# EAGLE design IORELAY8 (EAGLE 9.5.1)
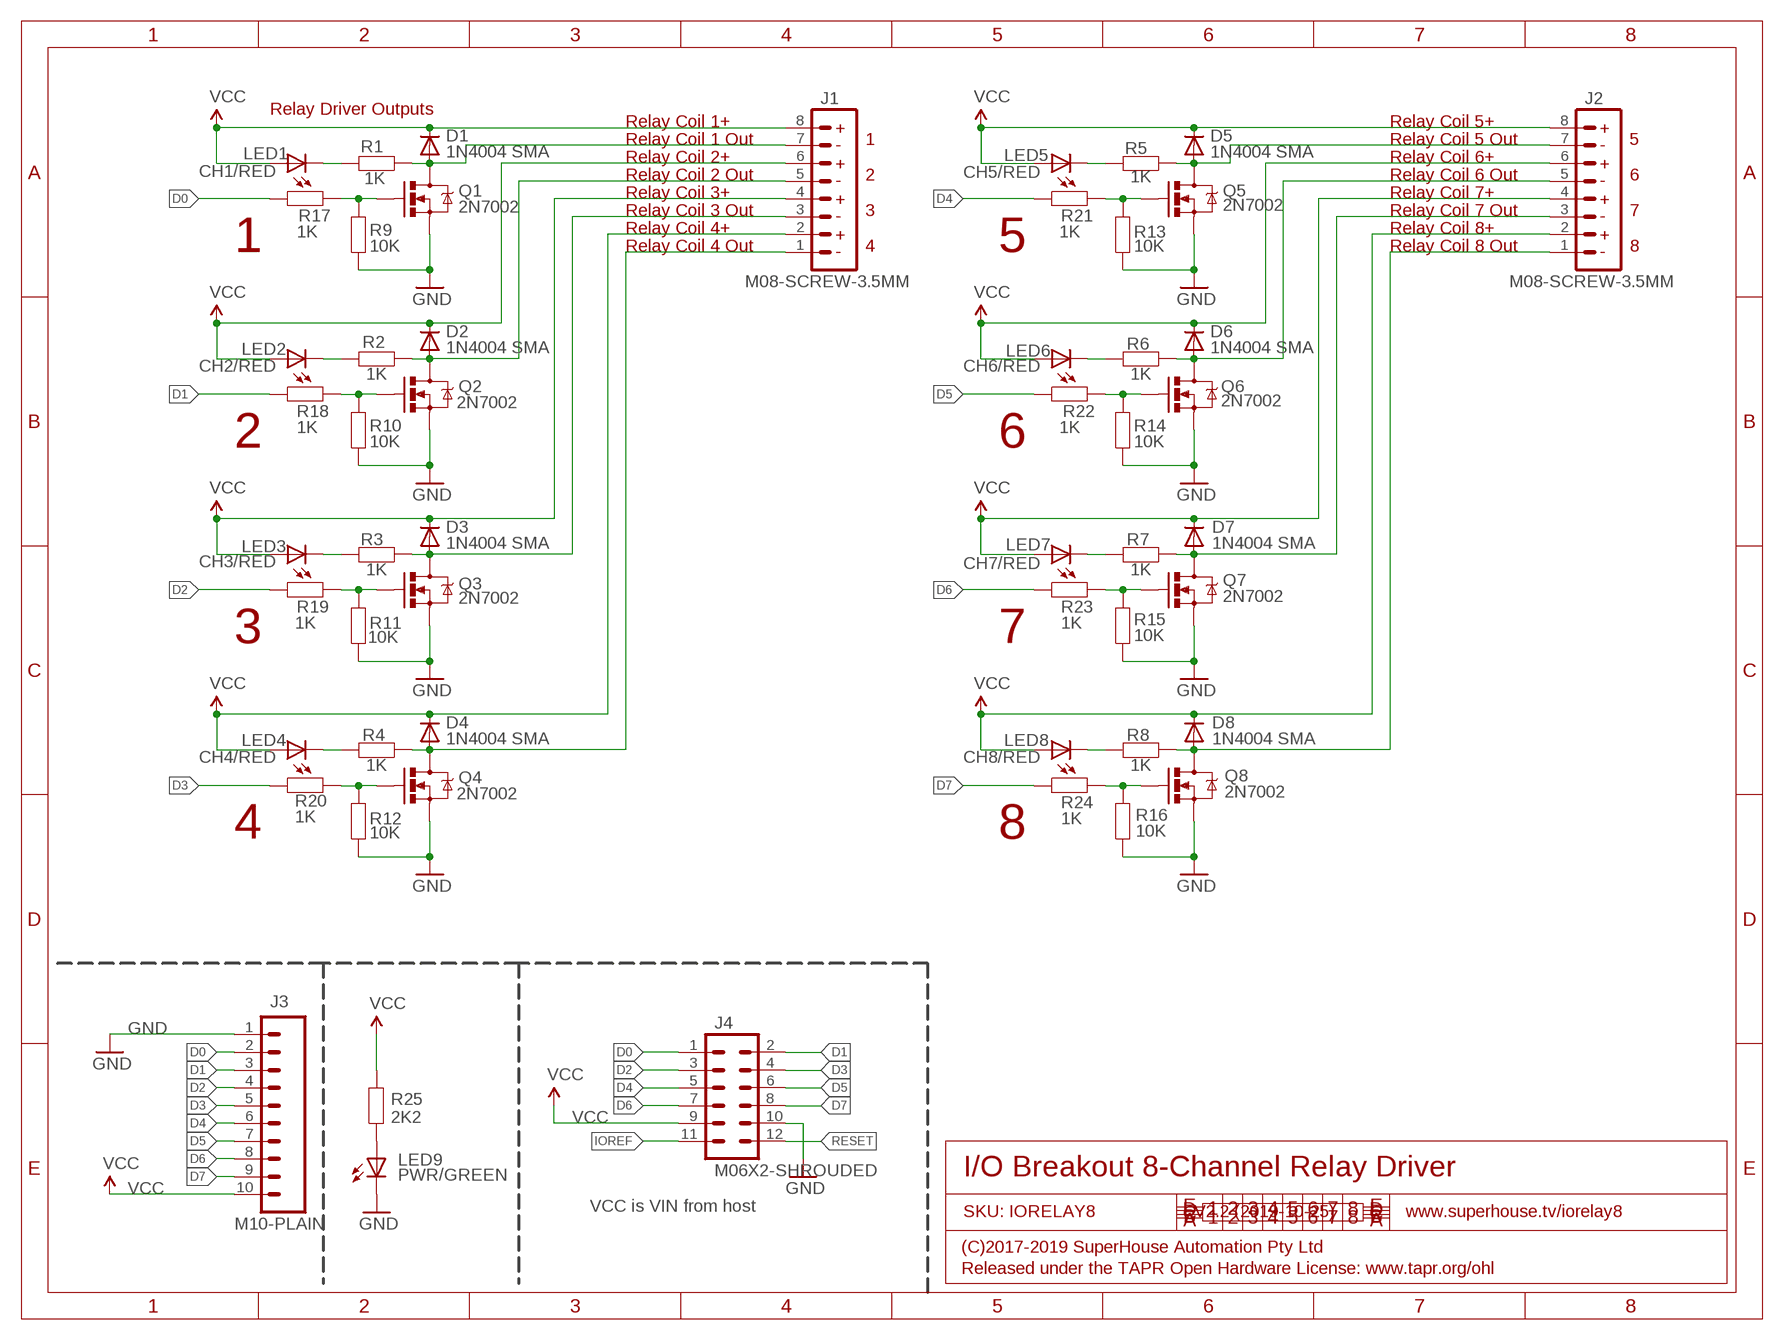
[diagram p0: schematic, sheet 1]

## Parts
D1  1N4004 SMA  DIODESMA  [SMA-DIODE]
D2  1N4004 SMA  DIODESMA  [SMA-DIODE]
D3  1N4004 SMA  DIODESMA  [SMA-DIODE]
D4  1N4004 SMA  DIODESMA  [SMA-DIODE]
D5  1N4004 SMA  DIODESMA  [SMA-DIODE]
D6  1N4004 SMA  DIODESMA  [SMA-DIODE]
D7  1N4004 SMA  DIODESMA  [SMA-DIODE]
D8  1N4004 SMA  DIODESMA  [SMA-DIODE]
J1  M08-SCREW-3.5MM  [SCREWTERMINAL_3.5MM_8]
J2  M08-SCREW-3.5MM  [SCREWTERMINAL_3.5MM_8]
J3  M10-PLAIN  [1X10]
J4  M06X2-SHROUDED  [2X6-SHROUDED]
LED1  CH1/RED  LED0603  [LED-0603]
LED2  CH2/RED  LED0603  [LED-0603]
LED3  CH3/RED  LED0603  [LED-0603]
LED4  CH4/RED  LED0603  [LED-0603]
LED5  CH5/RED  LED0603  [LED-0603]
LED6  CH6/RED  LED0603  [LED-0603]
LED7  CH7/RED  LED0603  [LED-0603]
LED8  CH8/RED  LED0603  [LED-0603]
LED9  PWR/GREEN  LED0603  [LED-0603]
Q1  2N7002  MOSFET-NCHANNEL-233  [SOT23-3]
Q2  2N7002  MOSFET-NCHANNEL-233  [SOT23-3]
Q3  2N7002  MOSFET-NCHANNEL-233  [SOT23-3]
Q4  2N7002  MOSFET-NCHANNEL-233  [SOT23-3]
Q5  2N7002  MOSFET-NCHANNEL-233  [SOT23-3]
Q6  2N7002  MOSFET-NCHANNEL-233  [SOT23-3]
Q7  2N7002  MOSFET-NCHANNEL-233  [SOT23-3]
Q8  2N7002  MOSFET-NCHANNEL-233  [SOT23-3]
R1  1K  RESISTOR0603  [R0603]
R2  1K  RESISTOR0603  [R0603]
R3  1K  RESISTOR0603  [R0603]
R4  1K  RESISTOR0603  [R0603]
R5  1K  RESISTOR0603  [R0603]
R6  1K  RESISTOR0603  [R0603]
R7  1K  RESISTOR0603  [R0603]
R8  1K  RESISTOR0603  [R0603]
R9  10K  RESISTOR0603  [R0603]
R10  10K  RESISTOR0603  [R0603]
R11  10K  RESISTOR0603  [R0603]
R12  10K  RESISTOR0603  [R0603]
R13  10K  RESISTOR0603  [R0603]
R14  10K  RESISTOR0603  [R0603]
R15  10K  RESISTOR0603  [R0603]
R16  10K  RESISTOR0603  [R0603]
R17  1K  RESISTOR0603  [R0603]
R18  1K  RESISTOR0603  [R0603]
R19  1K  RESISTOR0603  [R0603]
R20  1K  RESISTOR0603  [R0603]
R21  1K  RESISTOR0603  [R0603]
R22  1K  RESISTOR0603  [R0603]
R23  1K  RESISTOR0603  [R0603]
R24  1K  RESISTOR0603  [R0603]
R25  2K2  RESISTOR0603  [R0603]

## Nets
D0: J3.2 J4.1 R17.2
D1: J3.3 J4.2 R18.2
D2: J3.4 J4.3 R19.2
D3: J3.5 J4.4 R20.2
D4: J3.6 J4.5 R21.2
D5: J3.7 J4.6 R22.2
D6: J3.8 J4.7 R23.2
D7: J3.9 J4.8 R24.2
GND: J3.1 J4.10 LED9.C Q1.2(S) Q2.2(S) Q3.2(S) Q4.2(S) Q5.2(S) Q6.2(S) Q7.2(S) Q8.2(S) R9.1 R10.1 R11.1 R12.1 R13.1 R14.1 R15.1 R16.1
IOREF: J4.11
N$1: Q1.1(G) R9.2 R17.1
N$3: D2.A J1.5 Q2.3(D) R2.2
N$4: LED9.A R25.1
N$5: D1.A J1.7 Q1.3(D) R1.2
N$8: Q2.1(G) R10.2 R18.1
N$9: D3.A J1.3 Q3.3(D) R3.2
N$10: Q3.1(G) R11.2 R19.1
N$11: D4.A J1.1 Q4.3(D) R4.2
N$12: Q4.1(G) R12.2 R20.1
N$13: D5.A J2.7 Q5.3(D) R5.2
N$14: Q5.1(G) R13.2 R21.1
N$15: D6.A J2.5 Q6.3(D) R6.2
N$16: Q6.1(G) R14.2 R22.1
N$17: D7.A J2.3 Q7.3(D) R7.2
N$18: Q7.1(G) R15.2 R23.1
N$19: D8.A J2.1 Q8.3(D) R8.2
N$20: Q8.1(G) R16.2 R24.1
N$21: LED2.C R2.1
N$22: LED4.C R4.1
N$23: LED3.C R3.1
N$24: LED1.C R1.1
N$25: LED5.C R5.1
N$26: LED6.C R6.1
N$27: LED7.C R7.1
N$28: LED8.C R8.1
RESET: J4.12
VCC: D1.C D2.C D3.C D4.C D5.C D6.C D7.C D8.C J1.2 J1.4 J1.6 J1.8 J2.2 J2.4 J2.6 J2.8 J3.10 J4.9 LED1.A LED2.A LED3.A LED4.A LED5.A LED6.A LED7.A LED8.A R25.2

## Notes on the sheet
- Relay Driver Outputs
- Relay Coil 1+ | Relay Coil 5+
- + | +
- Relay Coil 1 Out | 1 | Relay Coil 5 Out | 5
- - | -
- Relay Coil 2+ | Relay Coil 6+
- + | +
- Relay Coil 2 Out | 2 | Relay Coil 6 Out | 6
- - | -
- Relay Coil 3+ | Relay Coil 7+
- + | +
- Relay Coil 3 Out | 3 | Relay Coil 7 Out | 7
- - | -
- Relay Coil 4+ | Relay Coil 8+
- + | +
- 1 | Relay Coil 4 Out | 4 | 5 | Relay Coil 8 Out | 8
- - | -
- 2 | 6
- 3 | 7
- 4 | 8
- I/O Breakout 8-Channel Relay Driver
- VCC is VIN from host
- SKU: IORELAY8 | V2.2 (2019-10-25) | www.superhouse.tv/iorelay8
- (C)2017-2019 SuperHouse Automation Pty Ltd
- Released under the TAPR Open Hardware License: www.tapr.org/ohl

## Library data of the parts
D1-D8 = SuperHouse-DiscreteSemi:DIODE: Diode Standard reverse protection diodes and small signal diodes. SMA package can handle up to about 1A. SOD-323 can handle about 200mA.
J1 J2 = SuperHouse-Connectors:M08: 8-way header Standard 1x8 header, and screw terminal variations
J3 = SuperHouse-Connectors:M10: 1x10 header
J4 = SuperHouse-Connectors:M06X2: M12 header in 2x6 format
LED1-LED9 = SuperHouse-LEDs:LED: LEDs Standard schematic elements and footprints for 5mm, 3mm, 1206, and 0603 sized LEDs. 5mm - Spark Fun Electronics SKU : COM-00529 (and others)
Q1-Q8 = SuperHouse-DiscreteSemi:MOSFET-NCHANNEL: N-channel MOSFET
R1-R25 = SuperHouse-DiscreteSemi:RESISTOR: Resistor Standard resistors.

## Board
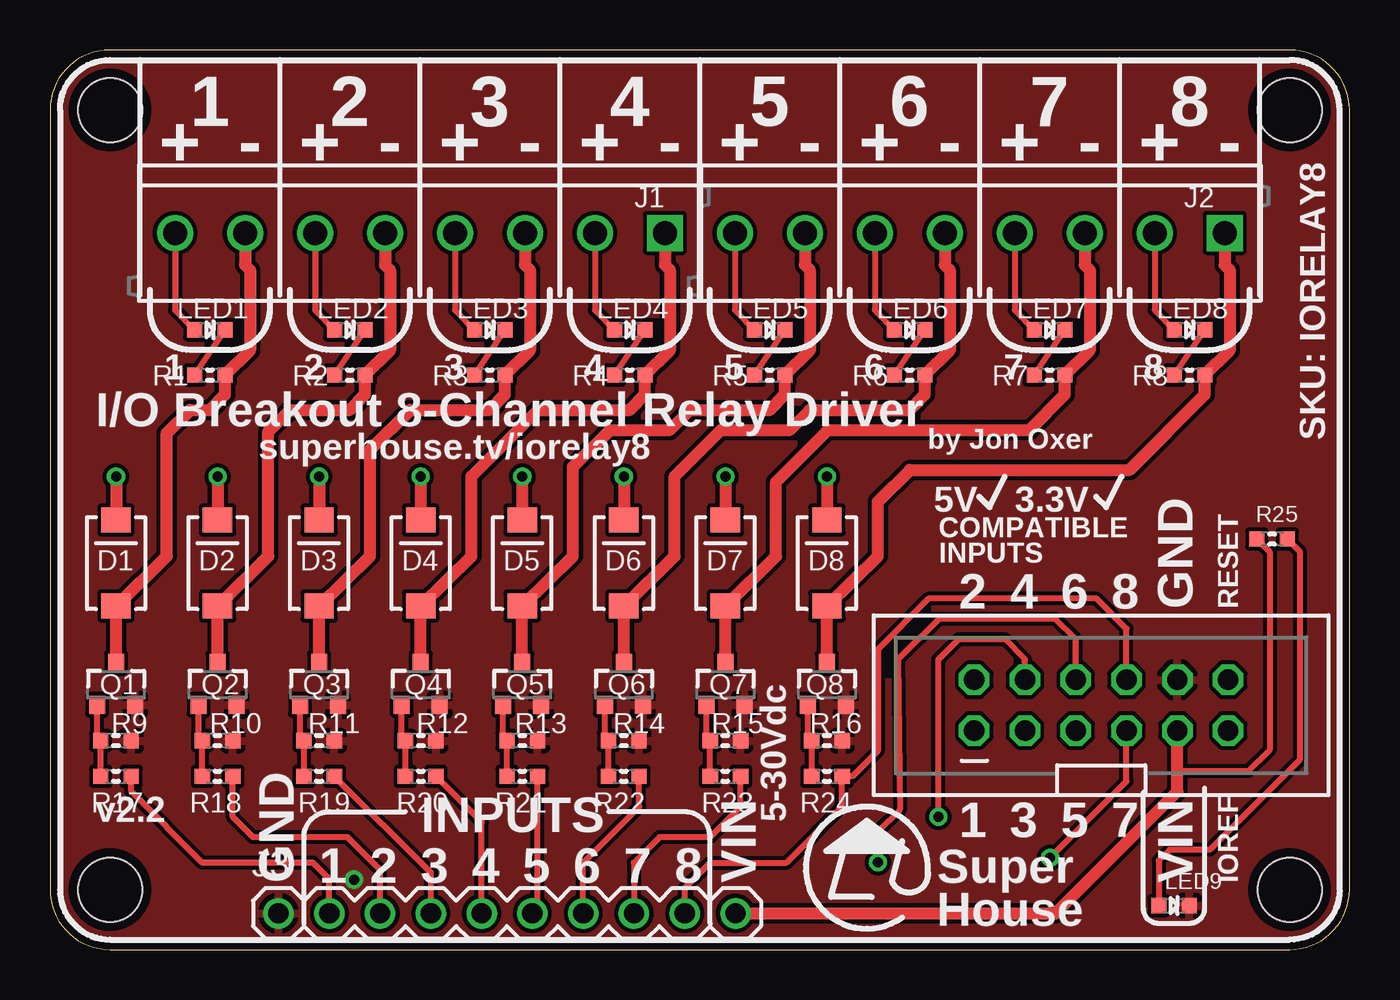
[diagram p1: board, top side]
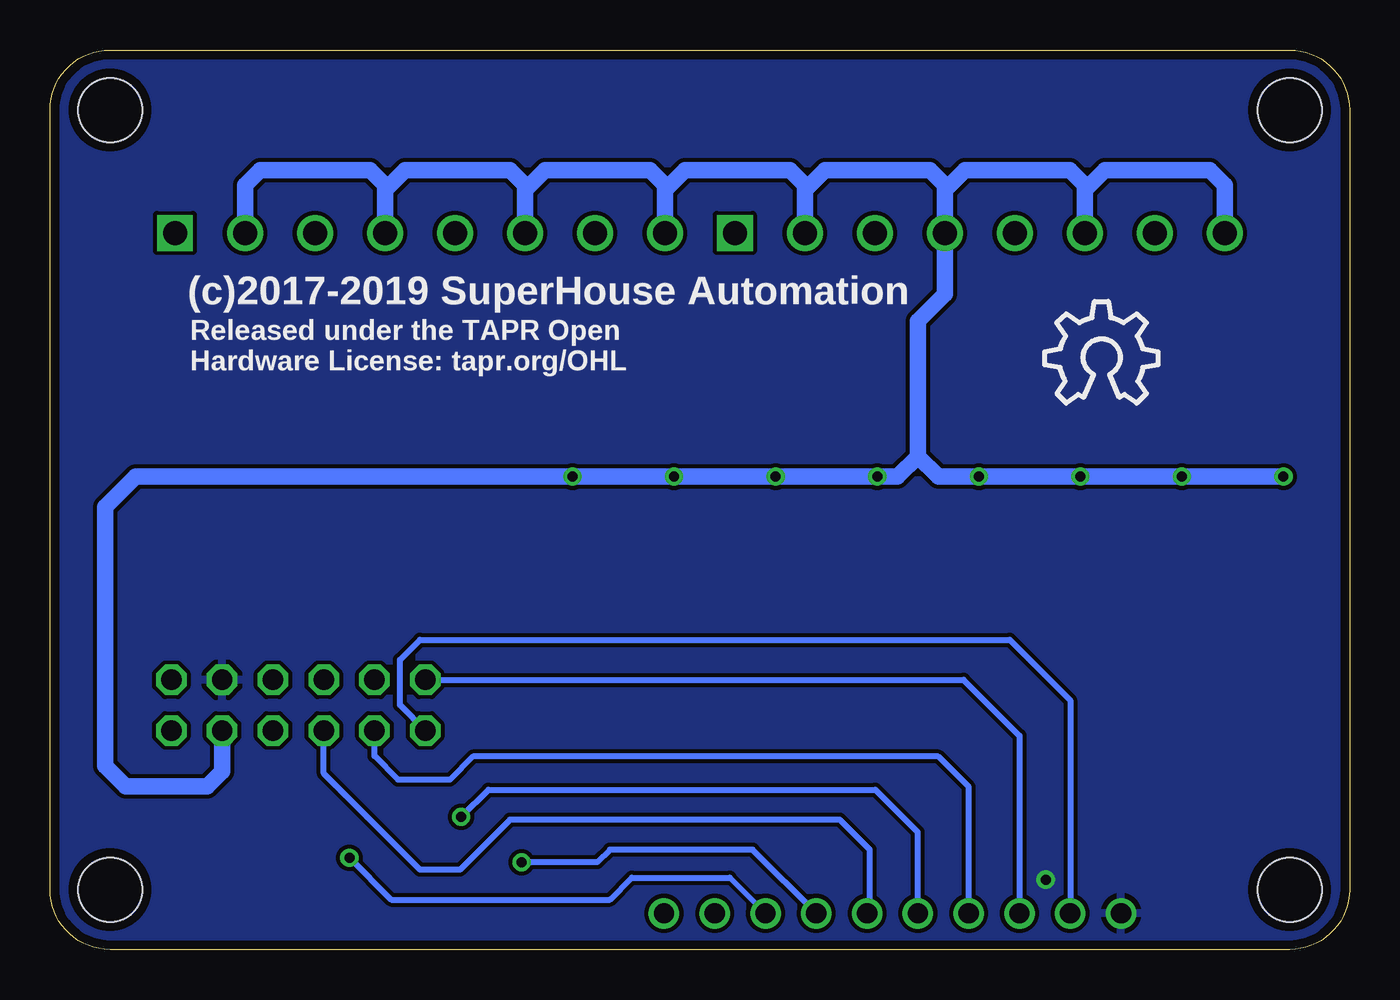
[diagram p2: board, bottom side, seen from below]

Size 65 x 45 mm. Coordinates in mm from the lower left corner, seen from the top.
Outline: 0,3 arc90 3,0 62,0 arc90 65,3 65,42 arc90 62,45 3,45 arc90 0,42 0,3
Copper layers (1*16): Top 0.035mm / dielectric 1.5mm / Bottom 0.035mm
Design rules "SuperHouse-Design-Rules": minimum track width 10mil, minimum drill 24mil, track to track 8mil, track to pad 8mil, pad to pad 8mil, via to via 8mil, smd to smd 6mil, copper to edge 18mil, drill to drill 8mil, minimum pad ring 10mil, minimum via ring 8mil, stop-mask expansion 4mil, vias tented up to drill 0.5mm, thermal gap 10mil
Holes 3.2 mm at 3,3 62,3 3,42 62,42

### Footprints (pad centres in the part's own frame; a part is rotated, then mirrored left to right if it is on the bottom)
SMA-DIODE = smd 1.27 x 1.47: A -2.15,0; C 2.15,0
SCREWTERMINAL_3.5MM_8 = drill 1.2 square: 1 0,0 | drill 1.2: 2 3.5,0; 3 7,0; 4 10.5,0; 5 14,0; 6 17.5,0; 7 21,0; 8 24.5,0
1X10 = drill 1.016: 1 0,0; 2 2.54,0; 3 5.08,0; 4 7.62,0; 5 10.16,0; 6 12.7,0; 7 15.24,0; 8 17.78,0; 9 20.32,0; 10 22.86,0
2X6-SHROUDED = drill 1.016 octagon: 1 0,0; 2 2.54,0; 3 0,-2.54; 4 2.54,-2.54; 5 0,-5.08; 6 2.54,-5.08; 7 0,-7.62; 8 2.54,-7.62; 9 0,-10.16; 10 2.54,-10.16; 11 0,-12.7; 12 2.54,-12.7
LED-0603 = smd 0.762 x 0.762: A -0.762,0; C 0.762,0
SOT23-3 = smd 0.8 x 0.9: 1 -0.95,-1; 2 0.95,-1; 3 0,1.1
R0603 = smd 0.762 x 0.762: 1 -0.762,0; 2 0.762,0

### Placement (x,y rotation side)
D1  3.3,19.34 90 top
D2  8.38,19.34 90 top
D3  13.46,19.34 90 top
D4  18.54,19.34 90 top
D5  23.62,19.34 90 top
D6  28.7,19.34 90 top
D7  33.78,19.34 90 top
D8  38.86,19.34 90 top
J1  30.75,35.85 180 top
J2  58.75,35.85 180 top
J3  11.43,1.81 0 top
J4  46.23,10.95 90 top
LED1  8,31 0 top
LED2  15,31 0 top
LED3  22,31 0 top
LED4  29,31 0 top
LED5  36,31 0 top
LED6  43,31 0 top
LED7  50,31 0 top
LED8  57,31 0 top
LED9  56.22,2.2 0 top
Q1  3.3,13.24 0 top
Q2  8.38,13.24 0 top
Q3  13.46,13.24 0 top
Q4  18.54,13.24 0 top
Q5  23.62,13.24 0 top
Q6  28.7,13.24 0 top
Q7  33.78,13.24 0 top
Q8  38.86,13.24 0 top
R1  8,28.73 0 top
R2  15,28.73 0 top
R3  22,28.73 0 top
R4  29,28.73 0 top
R5  36,28.73 0 top
R6  43,28.73 0 top
R7  50,28.73 0 top
R8  57,28.73 0 top
R9  3.3,10.45 180 top
R10  8.38,10.45 180 top
R11  13.46,10.45 180 top
R12  18.54,10.45 180 top
R13  23.62,10.45 180 top
R14  28.7,10.45 180 top
R15  33.78,10.45 180 top
R16  38.86,10.45 180 top
R17  3.3,8.67 0 top
R18  8.38,8.67 0 top
R19  13.46,8.67 0 top
R20  18.54,8.67 0 top
R21  23.62,8.67 0 top
R22  28.7,8.67 0 top
R23  33.78,8.67 0 top
R24  38.86,8.67 0 top
R25  61.13,20.53 180 top
U$6  [OSHW_10X200_NOTEXT]  15.24,27.34 0 bottom

### Tracks (layer width: path | path; a pad name or v marks a point on that pad's centre or on a via)
D0
  Top 0.305: R17.2 4.06,7.91 7.62,4.35 13.15,4.35 13.97,3.53 J3.2
  Bottom 0.305: J4.1 47.5,12.23 47.5,14.5 46.5,15.5 17,15.5 13.97,12.47 J3.2
D1
  Top 0.305: R18.2 9.14,6.64 10.16,5.62 14.88,5.62 16.51,3.99 J3.3
  Bottom 0.305: J4.2 19.3,13.49 16.51,10.7 J3.3
D2
  Top 0.305: J3.4 19.05,3.84 R19.2
  Bottom 0.305: J3.4 19.05,8.14 20.57,9.66 43.84,9.66 45,8.5 47.59,8.5 48.77,9.68 J4.3
D3  (via drill 0.5)
  Top 0.305: v44.43,6.64 44.43,14.5 45.46,15.53 47.75,15.53 48.77,14.51 J4.4 | J3.5 21.59,6.38 R20.2
  Bottom 0.305: J3.5 21.59,5.87 23.72,8 43.07,8 v44.43,6.64
D4
  Top 0.305: J3.6 24.38,2.06 R21.2
  Bottom 0.305: J3.6 arc-90 24,1.94 24,5 25.5,6.5 42,6.5 44.5,4 46.5,4 51.31,8.81 J4.5
D5  (via drill 0.5)
  Top 0.305: R22.2 29.46,7.14 26.67,4.35 J3.7 | v41.42,4.37 41.42,5.92 42.5,7 42.42,14.51 44.45,16.54 50.29,16.54 51.31,15.53 J4.6
  Bottom 0.305: J3.7 29.86,5 37,5 37.63,4.37 v41.42,4.37
D6  (via drill 0.5)
  Top 0.305: R23.2 34.54,7.14 33.02,5.62 30.48,5.62 29.21,4.35 J3.8 | v50.02,4.59 53.85,8.41 J4.7
  Bottom 0.254: 30.99,3.59 J3.8
  Bottom 0.305: v50.02,4.59 47.93,2.5 37,2.5 35.91,3.59 30.99,3.59
D7
  Top 0.305: J4.8 53.85,16.04 52.33,17.56 43.94,17.56 41.4,15.02 41.4,9.93 40.14,8.67 R24.2 39.62,7.14 36.83,4.35 33.02,4.35 31.75,3.08 J3.9
GND  (via drill 0.5)
  other vias: 15.2,3.5
  pour Bottom: 0,42 arc-90 3,45 62,45 arc-90 65,42 65,3 arc-90 62,0 3,0 arc-90 0,3
  pour Top: 0,42 arc-90 3,45 62,45 arc-90 65,42 65,3 arc-90 62,0 3,0 arc-90 0,3
N$1
  Top 0.254: R9.2 2.35,10.63
  Top 0.305: R17.1 R9.2 | 2.35,10.63 Q1.1
N$3
  Top 0.61: Q2.3 D2.A 10.92,19.68 10.92,25.92 12,27 15,27 15.76,27.76 R2.2 17,29.97 17,34 16.75,34.25 J1.5
N$4
  Top 0.305: R25.1 62.5,19.92 62.5,9.5 58,5 56,5 55.46,4.46 LED9.A
N$5
  Top 0.61: Q1.3 D1.A 5.84,19.68 5.84,25.84 7,27 8,27 8.76,27.76 R1.2 10,29.97 10,34 9.75,34.25 J1.7
N$8
  Top 0.254: R10.2 7.43,10.63
  Top 0.305: R18.1 R10.2 | 7.43,10.63 Q2.1
N$9
  Top 0.61: Q3.3 D3.A 16,19.68 16,25 18,27 22,27 22.76,27.76 R3.2 24,29.97 24,34 23.75,34.25 J1.3
N$10
  Top 0.254: R11.2 12.51,10.63
  Top 0.305: R19.1 R11.2 | 12.51,10.63 Q3.1
N$11
  Top 0.61: Q4.3 D4.A 21.08,19.68 21.08,23.67 24.41,27 29,27 29.76,27.76 R4.2 31,29.97 31,34 30.75,34.25 J1.1
N$12
  Top 0.254: R12.2 17.59,10.63
  Top 0.305: R20.1 R12.2 | 17.59,10.63 Q4.1
N$13
  Top 0.61: Q5.3 D5.A 26.16,19.68 26.16,24.16 28,26 31,26 32,27 36,27 36.76,27.76 R5.2 38,29.97 38,34 37.75,34.25 J2.7
N$14
  Top 0.254: R13.2 22.67,10.63
  Top 0.305: R21.1 R13.2 | 22.67,10.63 Q5.1
N$15
  Top 0.61: Q6.3 D6.A 31.24,19.68 31.24,23.67 33.57,26 37,26 38,27 43,27 43.76,27.76 R6.2 45,29.97 45,34 44.75,34.25 J2.5
N$16
  Top 0.254: R14.2 27.75,10.63
  Top 0.305: R22.1 R14.2 | 27.75,10.63 Q6.1
N$17
  Top 0.61: Q7.3 D7.A 36.32,19.68 36.32,23.4 38.92,26 49,26 50.76,27.76 R7.2 52,29.97 52,34 51.75,34.25 J2.3
N$18
  Top 0.254: R15.2 32.83,10.63
  Top 0.305: R23.1 R15.2 | 32.83,10.63 Q7.1
N$19
  Top 0.61: Q8.3 D8.A 41.4,19.68 41.4,22.4 43,24 54,24 57.76,27.76 R8.2 59,29.97 59,34 58.75,34.25 J2.1
N$20
  Top 0.254: R16.2 37.91,10.63
  Top 0.305: R24.1 R16.2 | 37.91,10.63 Q8.1
N$21
  Top 0.305: R2.1 LED2.C
N$22
  Top 0.305: R4.1 LED4.C
N$23
  Top 0.305: R3.1 LED3.C
N$24
  Top 0.305: R1.1 LED1.C
N$25
  Top 0.305: R5.1 LED5.C
N$26
  Top 0.305: R6.1 LED6.C
N$27
  Top 0.305: R7.1 LED7.C
N$28
  Top 0.305: R8.1 LED8.C
VCC  (via drill 0.5)
  Top 0.305: J1.8 6.25,31.99 LED1.A | J1.6 13.25,31.99 LED2.A | J1.4 20.25,31.99 LED3.A | J1.2 27.25,31.99 LED4.A | J2.8 34.25,31.99 LED5.A | J2.6 41.25,31.99 LED6.A | J2.4 48.25,31.99 LED7.A | J2.2 55.25,31.99 LED8.A | R25.2 61,19.9 61,10 59.92,8.92 56.39,8.92
  Top 0.61: v38.86,23.65 D8.C | v3.3,23.65 D1.C | v8.38,23.65 D2.C | v13.46,23.65 D3.C | v18.54,23.65 D4.C | v23.62,23.65 D5.C | v28.7,23.65 D6.C | v33.78,23.65 D7.C | J3.10 50.29,1.81 56.39,7.91 56.39,8.92 J4.9
  Bottom 0.813: v3.3,23.65 v8.38,23.65 v13.46,23.65 v18.54,23.65 20.57,23.65 21.59,24.67 | J4.9 56.39,8.92 57.15,8.16 61.21,8.16 62.23,9.18 62.23,22.13 60.71,23.65 v38.86,23.65 v33.78,23.65 v28.7,23.65 v23.62,23.65 22.61,23.65 21.59,24.67 | 21.59,24.67 21.59,31.44 20.25,32.78 J1.4 20.25,38 | J1.6 13.25,38 | 13.25,38 13.25,38.25 14,39 19.25,39 20.25,38 | J1.8 6.25,38.25 7,39 12.25,39 13.25,38 | 20.25,38 20.25,38.25 21,39 26.25,39 27.25,38 | J1.2 27.25,38 | 27.25,38 27.25,38.25 28,39 33.25,39 34.25,38 | J2.8 34.25,38 | 34.25,38 34.25,38.25 35,39 40.25,39 41.25,38 | J2.6 41.25,38 | 41.25,38 41.25,38.25 42,39 47.25,39 48.25,38 | J2.4 48.25,38 | 48.25,38 48.25,38.25 49,39 54.5,39 55.25,38.25 J2.2

### Text on the board
tPlace: 1 | 2 | 3 | 4 | 5 | 6 | 7 | 8 | + | - | + | - | + | - | + | - | + | - | + | - | + | - | + | - | 1 | 2 | 3 | 4 | 5 | 6 | 7 | 8 | I/O Breakout 8-Channel Relay Driver | superhouse.tv/iorelay8 | by Jon Oxer | SKU: IORELAY8 | 5V | 3.3V | COMPATIBLE | INPUTS | 2 | 4 | 6 | 8 | GND | RESET | v2.2 | INPUTS | 5-30Vdc | 1 | 3 | 5 | 7 | GND | 1 | 2 | 3 | 4 | 5 | 6 | 7 | 8 | VIN | VIN | IOREF | Super / House
bPlace: (c)2017-2019 SuperHouse Automation | Released under the TAPR Open / Hardware License: tapr.org/OHL
tDocu: A | K | A | K | A | K | A | K | A | K | A | K | A | K | A | K | K | K | K | K | K | K | K | K | A | A | A | A | A | A | A | A | A | K